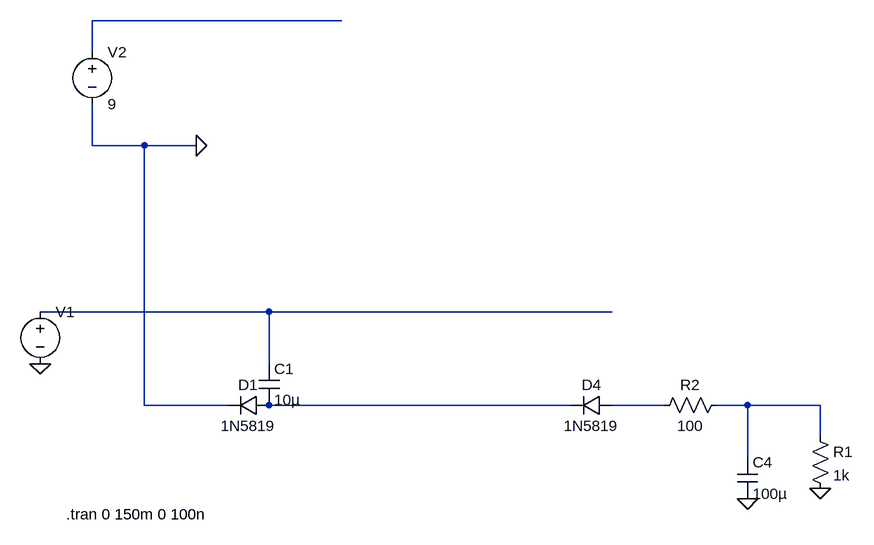
[diagram p0: schematic charge_pump .asc]
charge_pump .asc, the LTspice schematic file:
Version 4.1
SHEET 1 1856 768
WIRE 432 -240 48 -240
WIRE 48 -192 48 -240
WIRE 48 -48 48 -112
WIRE 128 -48 48 -48
WIRE 208 -48 128 -48
WIRE 320 208 -32 208
WIRE 848 208 320 208
WIRE 320 288 320 208
WIRE 128 352 128 -48
WIRE 256 352 128 352
WIRE 784 352 320 352
WIRE 928 352 848 352
WIRE 1056 352 1008 352
WIRE 1168 352 1056 352
WIRE 1168 400 1168 352
WIRE 1056 432 1056 352
FLAG -32 288 0
FLAG 208 -48 0
FLAG 1056 496 0
FLAG 1168 480 0
SYMBOL voltage -32 192 R0
WINDOW 3 24 96 Invisible 2
WINDOW 123 0 0 Left 0
WINDOW 39 0 0 Left 0
SYMATTR Value PULSE(0 9 0 10n 10n 33u 66u)
SYMATTR InstName V1
SYMBOL diode 848 336 R90
WINDOW 0 0 32 VBottom 2
WINDOW 3 32 32 VTop 2
SYMATTR InstName D4
SYMATTR Value 1N5819
SYMBOL cap 304 288 R0
SYMATTR InstName C1
SYMATTR Value 10µ
SYMBOL cap 1040 432 R0
SYMATTR InstName C4
SYMATTR Value 100µ
SYMBOL diode 320 336 R90
WINDOW 0 0 32 VBottom 2
WINDOW 3 32 32 VTop 2
SYMATTR InstName D1
SYMATTR Value 1N5819
SYMBOL voltage 48 -208 R0
WINDOW 123 0 0 Left 0
WINDOW 39 0 0 Left 0
SYMATTR InstName V2
SYMATTR Value 9
SYMBOL res 1024 336 R90
WINDOW 0 0 56 VBottom 2
WINDOW 3 32 56 VTop 2
SYMATTR InstName R2
SYMATTR Value 100
SYMBOL res 1152 384 R0
SYMATTR InstName R1
SYMATTR Value 1k
TEXT 8 520 Left 2 !.tran 0 150m 0 100n

The netlist it stands for:
* charge_pump .asc
V1 N002 0 PULSE(0 9 0 10n 10n 33u 66u)
D4 N004 N003 1N5819
C1 N002 N003 10µ
C4 N005 0 100µ
D1 N003 0 1N5819
V2 N001 0 9
R2 N005 N004 100
R1 N005 0 1k
.model D D
.lib standard.dio
.tran 0 150m 0 100n
.backanno
.end